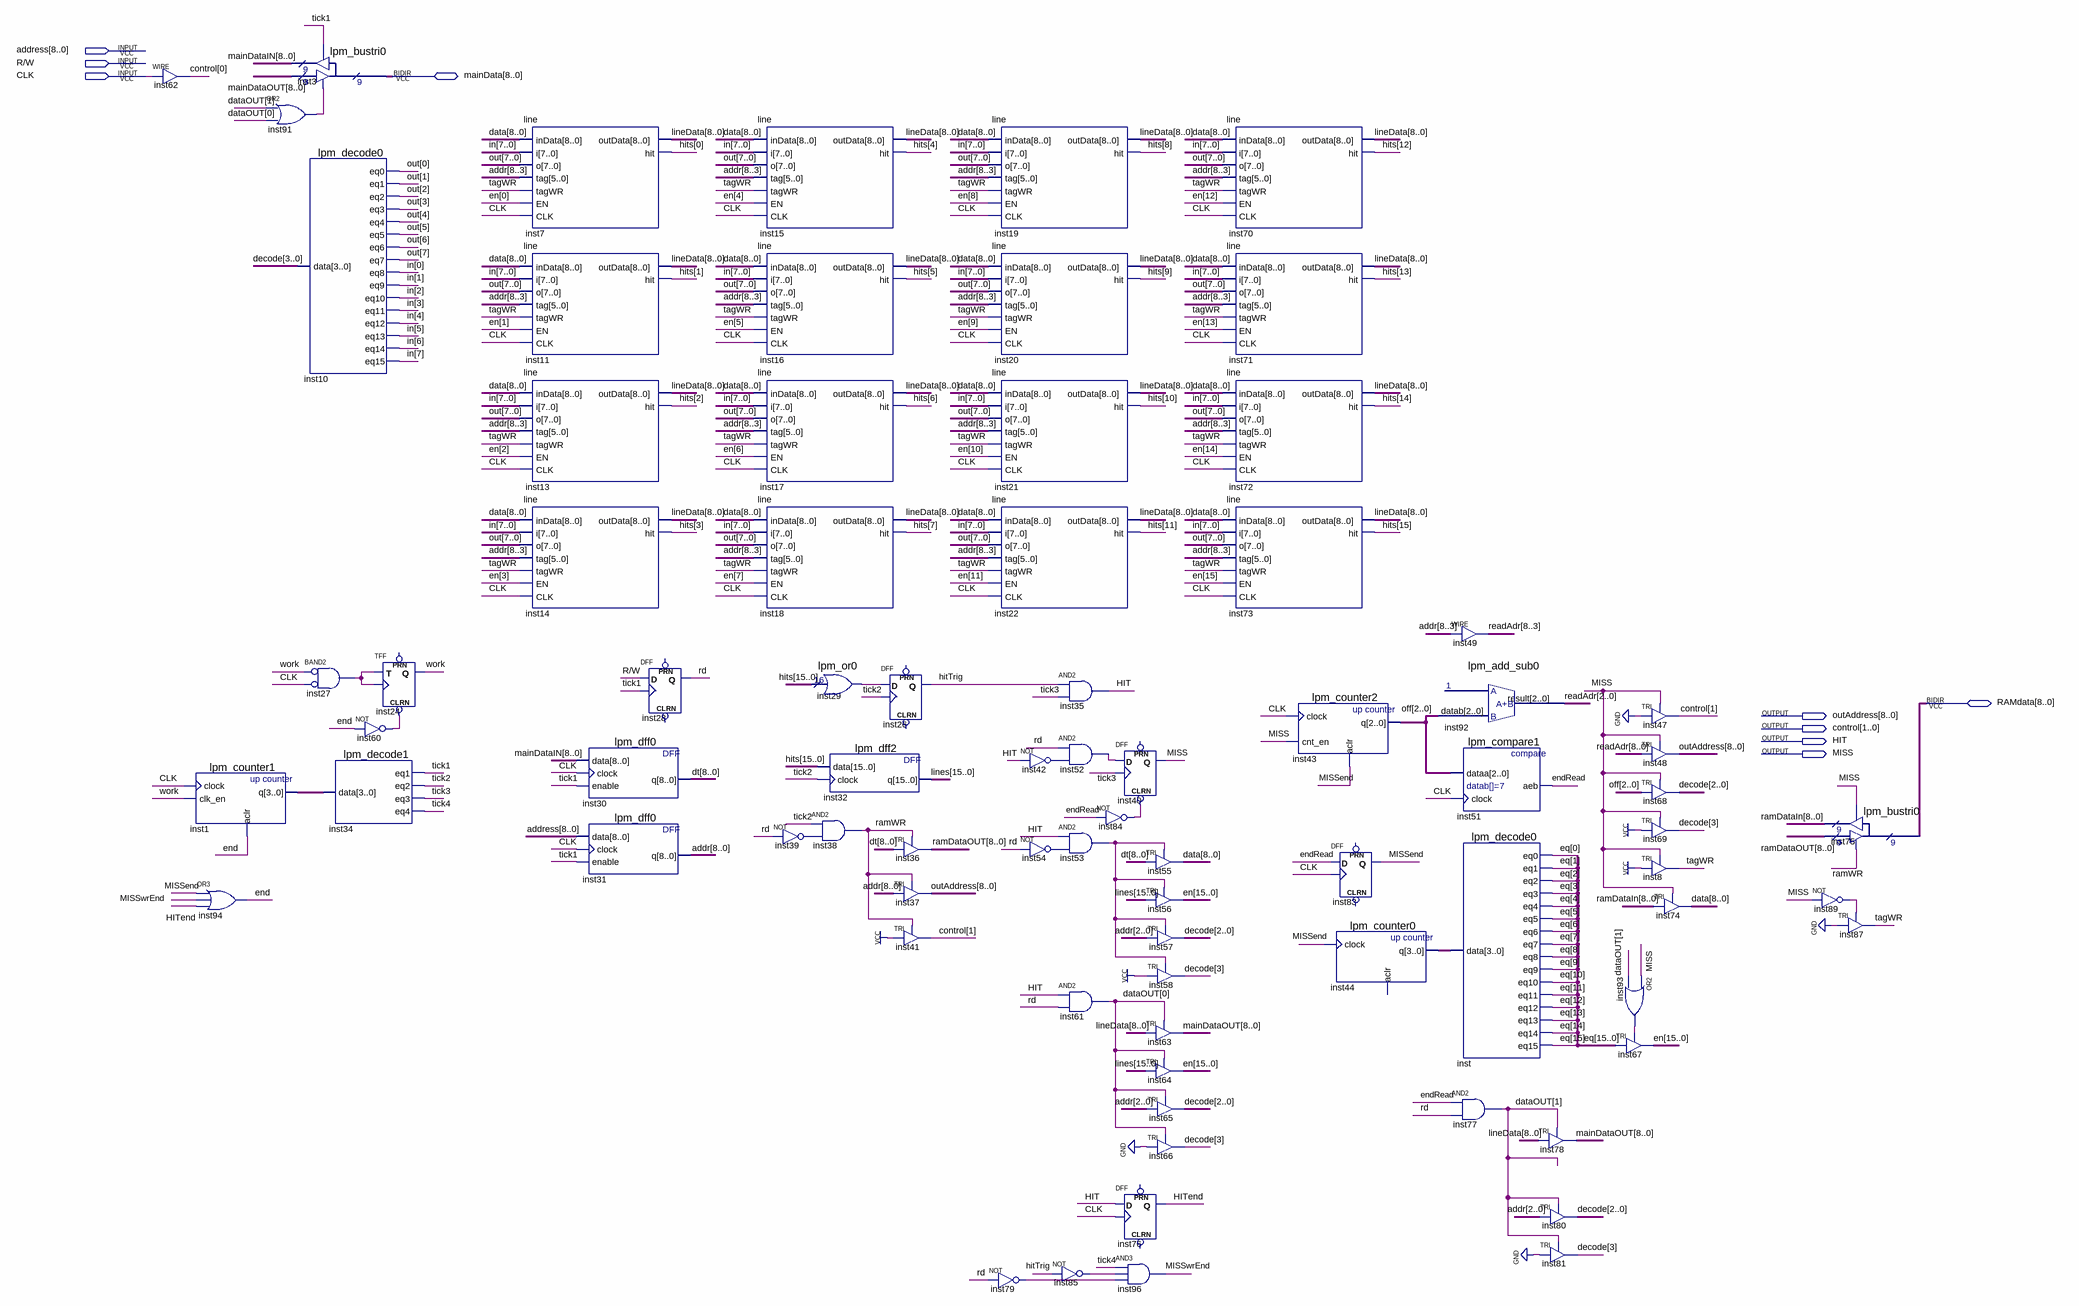
[diagram p0: schematic sheet]
// Quartus schematic cache.bdf as structural Verilog: 79 symbols, 9 pins
module cache (
  input  [8:0] address,
  input  \R/W ,
  input  CLK,
  inout  [8:0] mainData,
  inout  [8:0] RAMdata,
  output [8:0] outAddress,
  output [1:0] control,
  output HIT,
  output MISS
);

  wire \end , endRead, HITend, hitTrig, inst27_out, inst29_result, inst39_out, inst42_out, inst52_out,
       inst53_out, inst54_out, inst60_out, inst79_out, inst84_out, inst85_out, inst89_out, inst91_out,
       inst93_out, MISSend, MISSwrEnd, ramWR, rd, tagWR, tick1, tick2, tick3, tick4, work;
  wire [1:0] dataOUT;
  wire [2:0] off;
  wire [3:0] decode, inst1_q, inst44_q;
  wire [7:0] in, out;
  wire [8:0] addr, data, dt, lineData, mainDataIN, mainDataOUT, ramDataIn, ramDataOUT, readAdr;
  wire [15:0] en, eq, hits, lines;

  assign control[0] = CLK;  // WIRE inst62
  lpm_counter1 inst1 (.clock(CLK), .clk_en(work), .aclr(\end ), .q(inst1_q));
  or inst94 (\end , MISSend, MISSwrEnd, HITend);
  or inst91 (inst91_out, dataOUT[1], dataOUT[0]);
  lpm_bustri0 inst3 (
    .enabledt(inst91_out), .data(mainDataOUT), .enabletr(tick1), .result(mainDataIN), .tridata(mainData));
  lpm_decode0 inst10 (
    .data(decode), .eq0(out[0]), .eq1(out[1]), .eq2(out[2]), .eq3(out[3]), .eq4(out[4]), .eq5(out[5]),
    .eq6(out[6]), .eq7(out[7]), .eq8(in[0]), .eq9(in[1]), .eq10(in[2]), .eq11(in[3]), .eq12(in[4]),
    .eq13(in[5]), .eq14(in[6]), .eq15(in[7]));
  and inst27 (inst27_out, ~work, ~CLK);  // BAND2
  not inst60 (inst60_out, \end );
  lpm_decode1 inst34 (.data(inst1_q), .eq1(tick1), .eq2(tick2), .eq3(tick3), .eq4(tick4));
  TFF inst24 (.CLRN(inst60_out), .T(inst27_out), .CLK(inst27_out), .Q(work));  // open: PRN
  line inst7 (
    .inData(data), .i(in), .o(out), .tag(addr[8:3]), .tagWR(tagWR), .EN(en[0]), .CLK(CLK),
    .outData(lineData), .hit(hits[0]));
  line inst11 (
    .inData(data), .i(in), .o(out), .tag(addr[8:3]), .tagWR(tagWR), .EN(en[1]), .CLK(CLK),
    .outData(lineData), .hit(hits[1]));
  line inst13 (
    .inData(data), .i(in), .o(out), .tag(addr[8:3]), .tagWR(tagWR), .EN(en[2]), .CLK(CLK),
    .outData(lineData), .hit(hits[2]));
  line inst14 (
    .inData(data), .i(in), .o(out), .tag(addr[8:3]), .tagWR(tagWR), .EN(en[3]), .CLK(CLK),
    .outData(lineData), .hit(hits[3]));
  lpm_dff0 inst30 (.data(mainDataIN), .clock(CLK), .enable(tick1), .q(dt));
  lpm_dff0 inst31 (.data(address), .clock(CLK), .enable(tick1), .q(addr));
  DFF inst28 (.CLK(tick1), .D(\R/W ), .Q(rd));  // open: CLRN, PRN
  line inst15 (
    .inData(data), .i(in), .o(out), .tag(addr[8:3]), .tagWR(tagWR), .EN(en[4]), .CLK(CLK),
    .outData(lineData), .hit(hits[4]));
  line inst16 (
    .inData(data), .i(in), .o(out), .tag(addr[8:3]), .tagWR(tagWR), .EN(en[5]), .CLK(CLK),
    .outData(lineData), .hit(hits[5]));
  line inst17 (
    .inData(data), .i(in), .o(out), .tag(addr[8:3]), .tagWR(tagWR), .EN(en[6]), .CLK(CLK),
    .outData(lineData), .hit(hits[6]));
  line inst18 (
    .inData(data), .i(in), .o(out), .tag(addr[8:3]), .tagWR(tagWR), .EN(en[7]), .CLK(CLK),
    .outData(lineData), .hit(hits[7]));
  not inst39 (inst39_out, rd);
  lpm_or0 inst29 (.data(hits), .result(inst29_result));
  lpm_dff2 inst32 (.data(hits), .clock(tick2), .q(lines));
  and inst38 (ramWR, tick2, inst39_out);
  DFF inst26 (.CLK(tick2), .D(inst29_result), .Q(hitTrig));  // open: CLRN, PRN
  TRI inst36[8:0] (.IN(dt), .OE(ramWR), .OUT(ramDataOUT));
  TRI inst37[8:0] (.IN(addr), .OE(ramWR), .OUT(outAddress));
  TRI inst41 (.IN(1'b1), .OE(ramWR), .OUT(control[1]));
  line inst19 (
    .inData(data), .i(in), .o(out), .tag(addr[8:3]), .tagWR(tagWR), .EN(en[8]), .CLK(CLK),
    .outData(lineData), .hit(hits[8]));
  line inst20 (
    .inData(data), .i(in), .o(out), .tag(addr[8:3]), .tagWR(tagWR), .EN(en[9]), .CLK(CLK),
    .outData(lineData), .hit(hits[9]));
  line inst21 (
    .inData(data), .i(in), .o(out), .tag(addr[8:3]), .tagWR(tagWR), .EN(en[10]), .CLK(CLK),
    .outData(lineData), .hit(hits[10]));
  line inst22 (
    .inData(data), .i(in), .o(out), .tag(addr[8:3]), .tagWR(tagWR), .EN(en[11]), .CLK(CLK),
    .outData(lineData), .hit(hits[11]));
  not inst42 (inst42_out, HIT);
  not inst54 (inst54_out, rd);
  not inst79 (inst79_out, rd);
  and inst35 (HIT, hitTrig, tick3);
  and inst52 (inst52_out, rd, inst42_out);
  and inst53 (inst53_out, HIT, inst54_out);
  and inst61 (dataOUT[0], HIT, rd);
  not inst85 (inst85_out, hitTrig);
  DFF inst40 (.CLRN(inst84_out), .CLK(tick3), .D(inst52_out), .Q(MISS));  // open: PRN
  not inst84 (inst84_out, endRead);
  DFF inst76 (.CLK(CLK), .D(HIT), .Q(HITend));  // open: CLRN, PRN
  and inst96 (MISSwrEnd, tick4, inst85_out, inst79_out);
  TRI inst55[8:0] (.IN(dt), .OE(inst53_out), .OUT(data));
  TRI inst56[15:0] (.IN(lines), .OE(inst53_out), .OUT(en));
  TRI inst57[2:0] (.IN(addr[2:0]), .OE(inst53_out), .OUT(decode[2:0]));
  TRI inst58 (.IN(1'b1), .OE(inst53_out), .OUT(decode[3]));
  TRI inst63[8:0] (.IN(lineData), .OE(dataOUT[0]), .OUT(mainDataOUT));
  TRI inst64[15:0] (.IN(lines), .OE(dataOUT[0]), .OUT(en));
  TRI inst65[2:0] (.IN(addr[2:0]), .OE(dataOUT[0]), .OUT(decode[2:0]));
  TRI inst66 (.IN(1'b0), .OE(dataOUT[0]), .OUT(decode[3]));
  line inst70 (
    .inData(data), .i(in), .o(out), .tag(addr[8:3]), .tagWR(tagWR), .EN(en[12]), .CLK(CLK),
    .outData(lineData), .hit(hits[12]));
  line inst71 (
    .inData(data), .i(in), .o(out), .tag(addr[8:3]), .tagWR(tagWR), .EN(en[13]), .CLK(CLK),
    .outData(lineData), .hit(hits[13]));
  line inst72 (
    .inData(data), .i(in), .o(out), .tag(addr[8:3]), .tagWR(tagWR), .EN(en[14]), .CLK(CLK),
    .outData(lineData), .hit(hits[14]));
  line inst73 (
    .inData(data), .i(in), .o(out), .tag(addr[8:3]), .tagWR(tagWR), .EN(en[15]), .CLK(CLK),
    .outData(lineData), .hit(hits[15]));
  lpm_counter2 inst43 (.clock(CLK), .cnt_en(MISS), .aclr(MISSend), .q(off));
  DFF inst83 (.CLK(CLK), .D(endRead), .Q(MISSend));  // open: CLRN, PRN
  lpm_counter0 inst44 (.clock(MISSend), .q(inst44_q));  // open: aclr
  assign readAdr[8:3] = addr[8:3];  // WIRE inst49
  lpm_add_sub0 inst92 (.datab(off), .result(readAdr[2:0]));
  lpm_compare1 inst51 (.dataa(off), .clock(CLK), .aeb(endRead));
  lpm_decode0 inst (
    .data(inst44_q), .eq0(eq[0]), .eq1(eq[1]), .eq2(eq[2]), .eq3(eq[3]), .eq4(eq[4]), .eq5(eq[5]),
    .eq6(eq[6]), .eq7(eq[7]), .eq8(eq[8]), .eq9(eq[9]), .eq10(eq[10]), .eq11(eq[11]), .eq12(eq[12]),
    .eq13(eq[13]), .eq14(eq[14]), .eq15(eq[15]));
  and inst77 (dataOUT[1], endRead, rd);
  TRI inst78[8:0] (.IN(lineData), .OE(dataOUT[1]), .OUT(mainDataOUT));
  TRI inst80[2:0] (.IN(addr[2:0]), .OE(dataOUT[1]), .OUT(decode[2:0]));
  TRI inst81 (.IN(1'b0), .OE(dataOUT[1]), .OUT(decode[3]));
  or inst93 (inst93_out, MISS, dataOUT[1]);
  TRI inst67[15:0] (.IN(eq), .OE(inst93_out), .OUT(en));
  TRI inst47 (.IN(1'b0), .OE(MISS), .OUT(control[1]));
  TRI inst48[8:0] (.IN(readAdr), .OE(MISS), .OUT(outAddress));
  TRI inst68[2:0] (.IN(off), .OE(MISS), .OUT(decode[2:0]));
  TRI inst69 (.IN(1'b1), .OE(MISS), .OUT(decode[3]));
  TRI inst8 (.IN(1'b1), .OE(MISS), .OUT(tagWR));
  TRI inst74[8:0] (.IN(ramDataIn), .OE(MISS), .OUT(data));
  lpm_bustri0 inst75 (.enabledt(ramWR), .data(ramDataOUT), .enabletr(MISS), .result(ramDataIn), .tridata(RAMdata));
  not inst89 (inst89_out, MISS);
  TRI inst87 (.IN(1'b0), .OE(inst89_out), .OUT(tagWR));
endmodule
